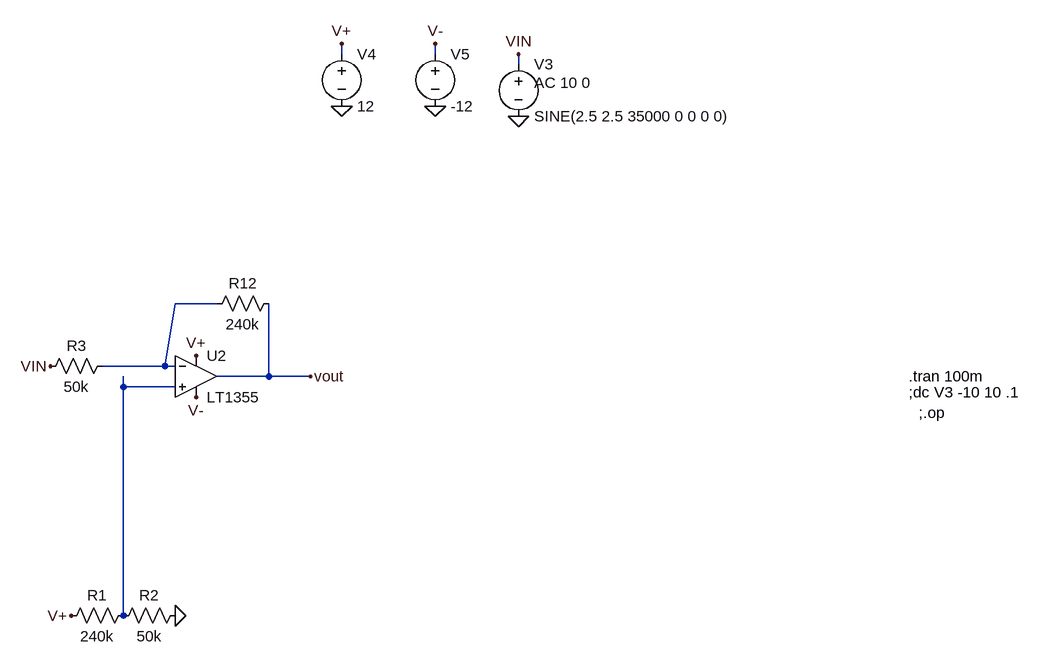
[diagram p0: schematic summer.asc]
summer.asc, the LTspice schematic file:
Version 4
SHEET 1 992 932
WIRE -80 -224 -80 -240
WIRE 64 -224 64 -240
WIRE 192 -208 192 -224
WIRE -272 160 -336 160
WIRE -352 256 -336 160
WIRE -352 256 -448 256
WIRE -336 256 -352 256
WIRE -192 272 -192 160
WIRE -192 272 -272 272
WIRE -128 272 -192 272
WIRE -416 288 -416 272
WIRE -336 288 -416 288
WIRE -416 640 -416 288
FLAG 192 -128 0
FLAG 192 -224 VIN
FLAG -80 -144 0
FLAG 64 -144 0
FLAG -80 -240 V+
FLAG 64 -240 V-
FLAG -128 272 vout
FLAG -528 256 VIN
FLAG -496 640 V+
FLAG -336 640 0
FLAG -304 240 V+
FLAG -304 304 V-
SYMBOL voltage 192 -224 R0
WINDOW 123 24 44 Left 2
WINDOW 39 0 0 Left 2
SYMATTR Value2 AC 10 0
SYMATTR InstName V3
SYMATTR Value SINE(2.5 2.5 35000 0 0 0 0)
SYMBOL voltage -80 -240 R0
WINDOW 123 0 0 Left 2
WINDOW 39 0 0 Left 2
SYMATTR InstName V4
SYMATTR Value 12
SYMBOL voltage 64 -240 R0
WINDOW 123 0 0 Left 2
WINDOW 39 0 0 Left 2
SYMATTR InstName V5
SYMATTR Value -12
SYMBOL res -176 144 R90
WINDOW 0 0 56 VBottom 2
WINDOW 3 32 56 VTop 2
SYMATTR InstName R12
SYMATTR Value 240k
SYMBOL res -400 624 R90
WINDOW 0 0 56 VBottom 2
WINDOW 3 32 56 VTop 2
SYMATTR InstName R1
SYMATTR Value 240k
SYMBOL res -320 624 R90
WINDOW 0 0 56 VBottom 2
WINDOW 3 32 56 VTop 2
SYMATTR InstName R2
SYMATTR Value 50k
SYMBOL res -432 240 R90
WINDOW 0 0 56 VBottom 2
WINDOW 3 32 56 VTop 2
SYMATTR InstName R3
SYMATTR Value 50k
SYMBOL Opamps\\LT1355 -304 208 R0
SYMATTR InstName U2
TEXT 792 296 Left 2 !;dc V3 -10 10 .1
TEXT 792 272 Left 2 !.tran 100m
TEXT 808 328 Left 2 !;.op

The netlist it stands for:
* summer.asc
V3 VIN 0 SINE(2.5 2.5 35000 0 0 0 0) AC 10 0
V4 V+ 0 12
V5 V- 0 -12
R12 vout N001 240k
R1 N002 V+ 240k
R2 0 N002 50k
R3 N001 VIN 50k
XU2 N002 N001 V+ V- vout LT1355  ; pins In+ In- V+ V- OUT
;dc V3 -10 10 .1
.tran 100m
;.op
.backanno
.end